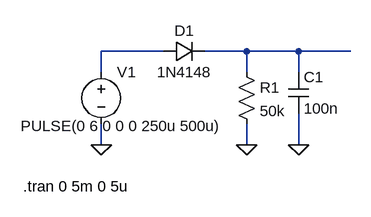
[diagram p0: schematic detecteur de crète.asc]
detecteur de crète.asc, the LTspice schematic file:
Version 4.1
SHEET 1 880 680
WIRE 112 96 16 96
WIRE 240 96 176 96
WIRE 320 96 240 96
WIRE 400 96 320 96
WIRE 16 128 16 96
WIRE 240 128 240 96
WIRE 320 128 320 96
WIRE 16 240 16 208
WIRE 240 240 240 208
WIRE 320 240 320 192
FLAG 16 240 0
FLAG 240 240 0
FLAG 320 240 0
SYMBOL cap 304 128 R0
SYMATTR InstName C1
SYMATTR Value 100n
SYMBOL res 224 112 R0
SYMATTR InstName R1
SYMATTR Value 50k
SYMBOL voltage 16 112 R0
WINDOW 3 -124 99 Left 2
WINDOW 123 0 0 Left 0
WINDOW 39 0 0 Left 0
SYMATTR InstName V1
SYMATTR Value PULSE(0 6 0 0 0 250u 500u)
SYMBOL diode 112 112 R270
WINDOW 0 32 32 VTop 2
WINDOW 3 0 32 VBottom 2
SYMATTR InstName D1
SYMATTR Value 1N4148
TEXT -104 304 Left 2 !.tran 0 5m 0 5u

The netlist it stands for:
* detecteur de crète.asc
C1 N002 0 100n
R1 N002 0 50k
V1 N001 0 PULSE(0 6 0 0 0 250u 500u)
D1 N001 N002 1N4148
.model D D
.lib standard.dio
.tran 0 5m 0 5u
.backanno
.end